# Altium schematic sheet MOSFET Board Schematics.SchDoc
size A4
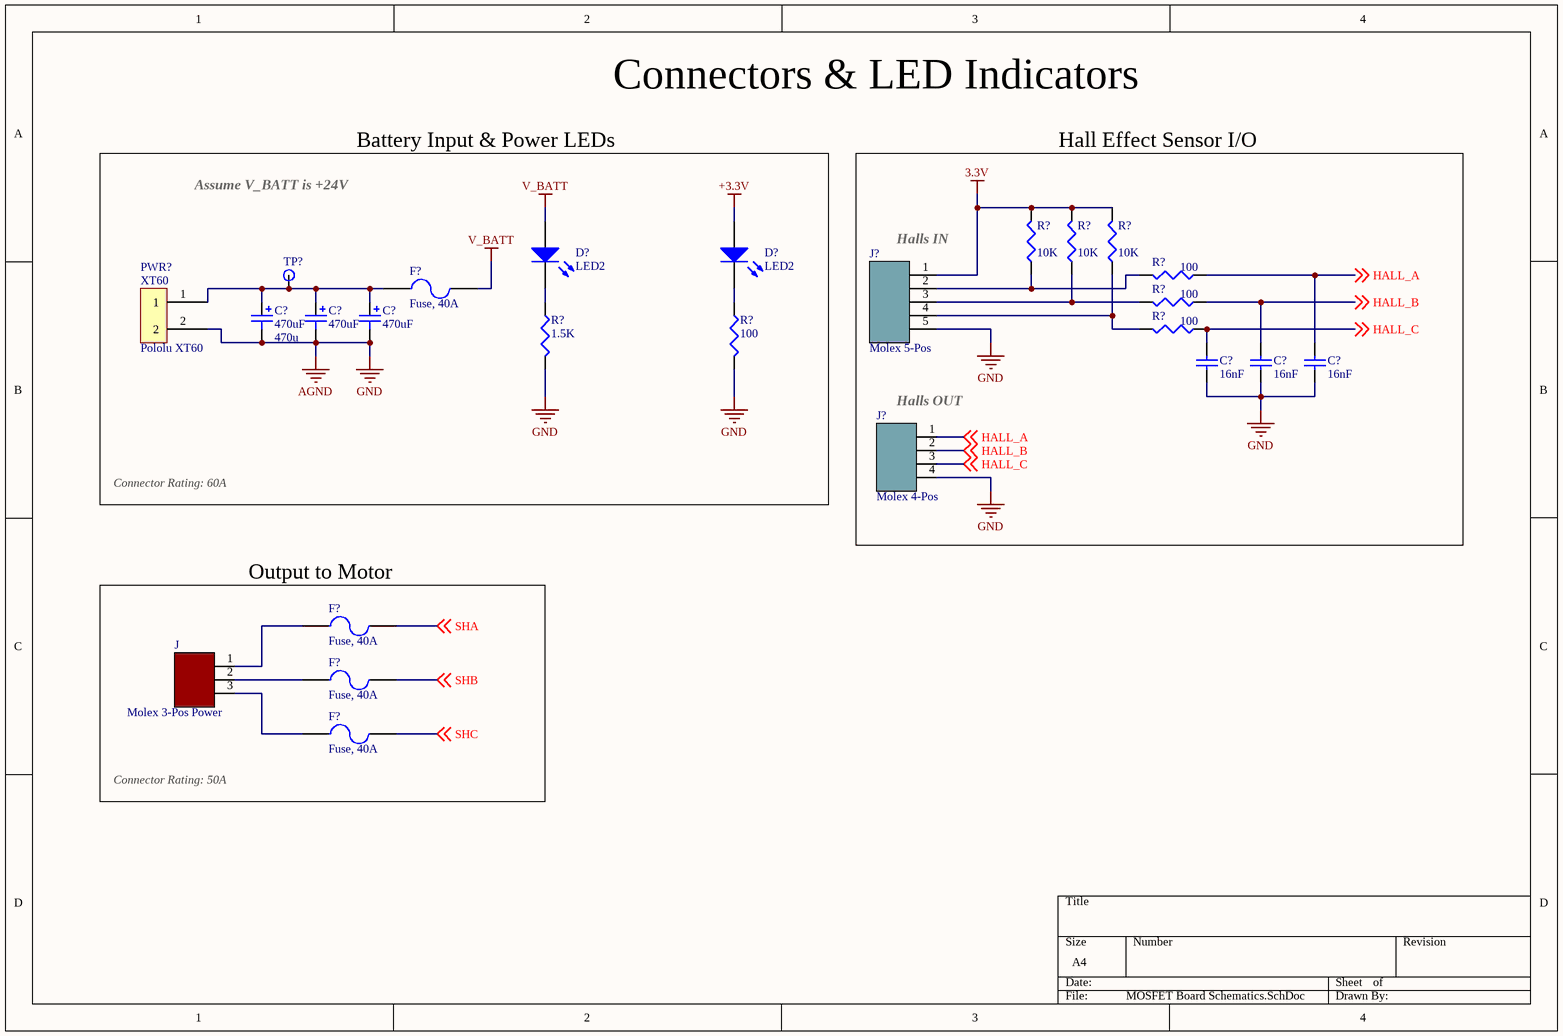
[diagram p0: MOSFET Board Schematics.SchDoc]

## Parts
(Parts that share a designator on the sheet are numbered #1, #2 ... from top to bottom, then left to right.)
C?#1  470uF  value 470u  [PCB-9e7goo2pp4p9aab9r63k-1]
C?#2  470uF  [PCB-9e7goo2pp4p9aab9r63k-1]
C?#3  470uF  [PCB-9e7goo2pp4p9aab9r63k-1]
C?#4  16nF  [CAPC2013X94X50LL20T25]
C?#5  16nF  [CAPC2013X94X50LL20T25]
C?#6  16nF  [CAPC2013X94X50LL20T25]
D?#1  LED2  [3.2X1.6X1.1]
D?#2  LED2  [3.2X1.6X1.1]
F?#1  Fuse, 40A  [PIN-W2/E2.8]
F?#2  Fuse, 40A  [PIN-W2/E2.8]
F?#3  Fuse, 40A  [PIN-W2/E2.8]
F?#4  Fuse, 40A  [PIN-W2/E2.8]
J  Molex 3-Pos Power
J?#1  Molex 5-Pos
J?#2  Molex 4-Pos
PWR?  Pololu XT60  [PCB-42h2ntsp5e5udn23h2hi-1]
R?#1  value 10K  [J1-0603]  (hidden comment: Res3)
R?#2  value 10K  [J1-0603]  (hidden comment: Res3)
R?#3  value 10K  [J1-0603]  (hidden comment: Res3)
R?#4  value 100  [J1-0603]  (hidden comment: Res3)
R?#5  value 1.5K  [J1-0603]  (hidden comment: Res3)
R?#6  value 100  [J1-0603]  (hidden comment: Res3)
R?#7  value 100  [J1-0603]  (hidden comment: Res3)
R?#8  value 100  [J1-0603]  (hidden comment: Res3)
TP?  50x60mil-pad  [PCB-iek5qk9ganu4yn12lo6h-1]  (value not drawn)

## Blocks framed on the sheet
Battery Input & Power LEDs: C?#1-C?#3 D?#1 D?#2 F?#1 PWR? R?#5 R?#6 TP?
Hall Effect Sensor I/O: C?#4-C?#6 J?#1 J?#2 R?#1-R?#4 R?#7 R?#8
Output to Motor: F?#2-F?#4 J

## Nets
3.3V: J?#1.1 R?#1.2 R?#2.2 R?#3.2
+3.3V: D?#2.1(A)
AGND: C?#1.2 C?#2.2 C?#3.2 C?#4.1 C?#5.1 C?#6.1 J?#1.5 J?#2.4 PWR?.2 R?#5.2 R?#6.2  [also labelled GND]
V_BATT: D?#1.1(A) F?#1.2
HALL_A: C?#6.2 J?#2.1 R?#4.1 ; off-sheet HALL_A
HALL_B: C?#5.2 J?#2.2 R?#7.1 ; off-sheet HALL_B
HALL_C: C?#4.2 J?#2.3 R?#8.1 ; off-sheet HALL_C
SHA: F?#2.2 ; off-sheet SHA
SHB: F?#3.2 ; off-sheet SHB
SHC: F?#4.2 ; off-sheet SHC
NetC?#1_1: C?#1.1 C?#2.1 C?#3.1 F?#1.1 PWR?.1 TP?.1
NetD?#1_2: D?#1.2(K) R?#5.1
NetD?#2_2: D?#2.2(K) R?#6.1
NetF?#2_1: F?#2.1 J.1
NetF?#3_1: F?#3.1 J.2
NetF?#4_1: F?#4.1 J.3
NetJ?#1_2: J?#1.2 R?#1.1 R?#4.2
NetJ?#1_3: J?#1.3 R?#2.1 R?#7.2
NetJ?#1_4: J?#1.4 R?#3.1 R?#8.2

## Notes on the sheet
- Connectors & LED Indicators
- Assume V_BATT is +24V
- (near J?#1) Halls IN
- (near J?#2) Halls OUT
- Connector Rating: 60A
- Connector Rating: 50A
- (in symbol XT60 YELLOW) XT60

## Library data of the parts
C?#1 C?#2 = CMP-7ff4b6fd6ba6a033-2: Cap Aluminum 470uF 63V 20% (12.5 X 20mm) Radial Aluminum Cylindrical Can 5mm 640mA 2000 hr 105°C Bulk
C?#3 = ECA-1JHG471: Cap Aluminum 470uF 63V 20% (12.5 X 20mm) Radial Aluminum Cylindrical Can 5mm 640mA 2000 hr 105°C Bulk
C?#4-C?#6 = 08055C183JAT2A: CAP CER 0.018UF 50V 5% X7R 0805; Capacitance: 1.8e-08 F; Case/Package (SI): 2012; Voltage Rating (DC): 50.0 V; Capacitance Tolerance: ±5%; Case/Package: 0805; Dielectric Characteristic: X7R; Mounting Style: Surface Mount; Number of Pins: 2; Octopart Url: https://octopart.com/08055c183jat2a-avx+interconnect+%2F+elco-6875274; OctopartID: 2cbfe5dde153f378; Packaging: Tape; RoHS: Compliant
D?#1 D?#2 = LED2: Typical RED, GREEN, YELLOW, AMBER GaAs LED; Published: 8-Jun-2000; LatestRevisionDate: 17-Jul-2002; LatestRevisionNote: Re-released for DXP Platform.; PackageVersion: Feb-2002; PackageReference: 3.2X1.6X1.1; Publisher: Altium Limited; PackageDescription: SM LED; 2 Flat Leads
F?#1-F?#4 = Fuse 2: Fuse; Published: 8-Jun-2000; LatestRevisionDate: 17-Jul-2002; LatestRevisionNote: Re-released for DXP Platform.; PackageReference: PIN-W2/E2.8; Publisher: Altium Limited; PackageDescription: Thru-Hole; 2 Leads
J = Molex 3-Pos Power (42819-2224)
J?#1 = Molex 5-Pos (0436450500)
J?#2 = Molex 4-Pos (0436450400)
PWR? = XT60 YELLOW: Power connector; 65A; PIN: 2; Module: yellow; Octopart URL: http://octopart.com/xt60+yellow-pololu-52633801
R?#1-R?#8 = Res3: Resistor; Published: 8-Jun-2000; LatestRevisionDate: 29-May-2009; LatestRevisionNote: IPC-7351 Footprint Added.; PackageReference: J1-0603; Publisher: Altium Limited; PackageDescription: Chip Resistor
TP? = CMP-da21135b2be305e6-10: SMT Circuit probe pad 50x60mil